# EAGLE design Layout_LEDs_Florian (EAGLE 5.07)
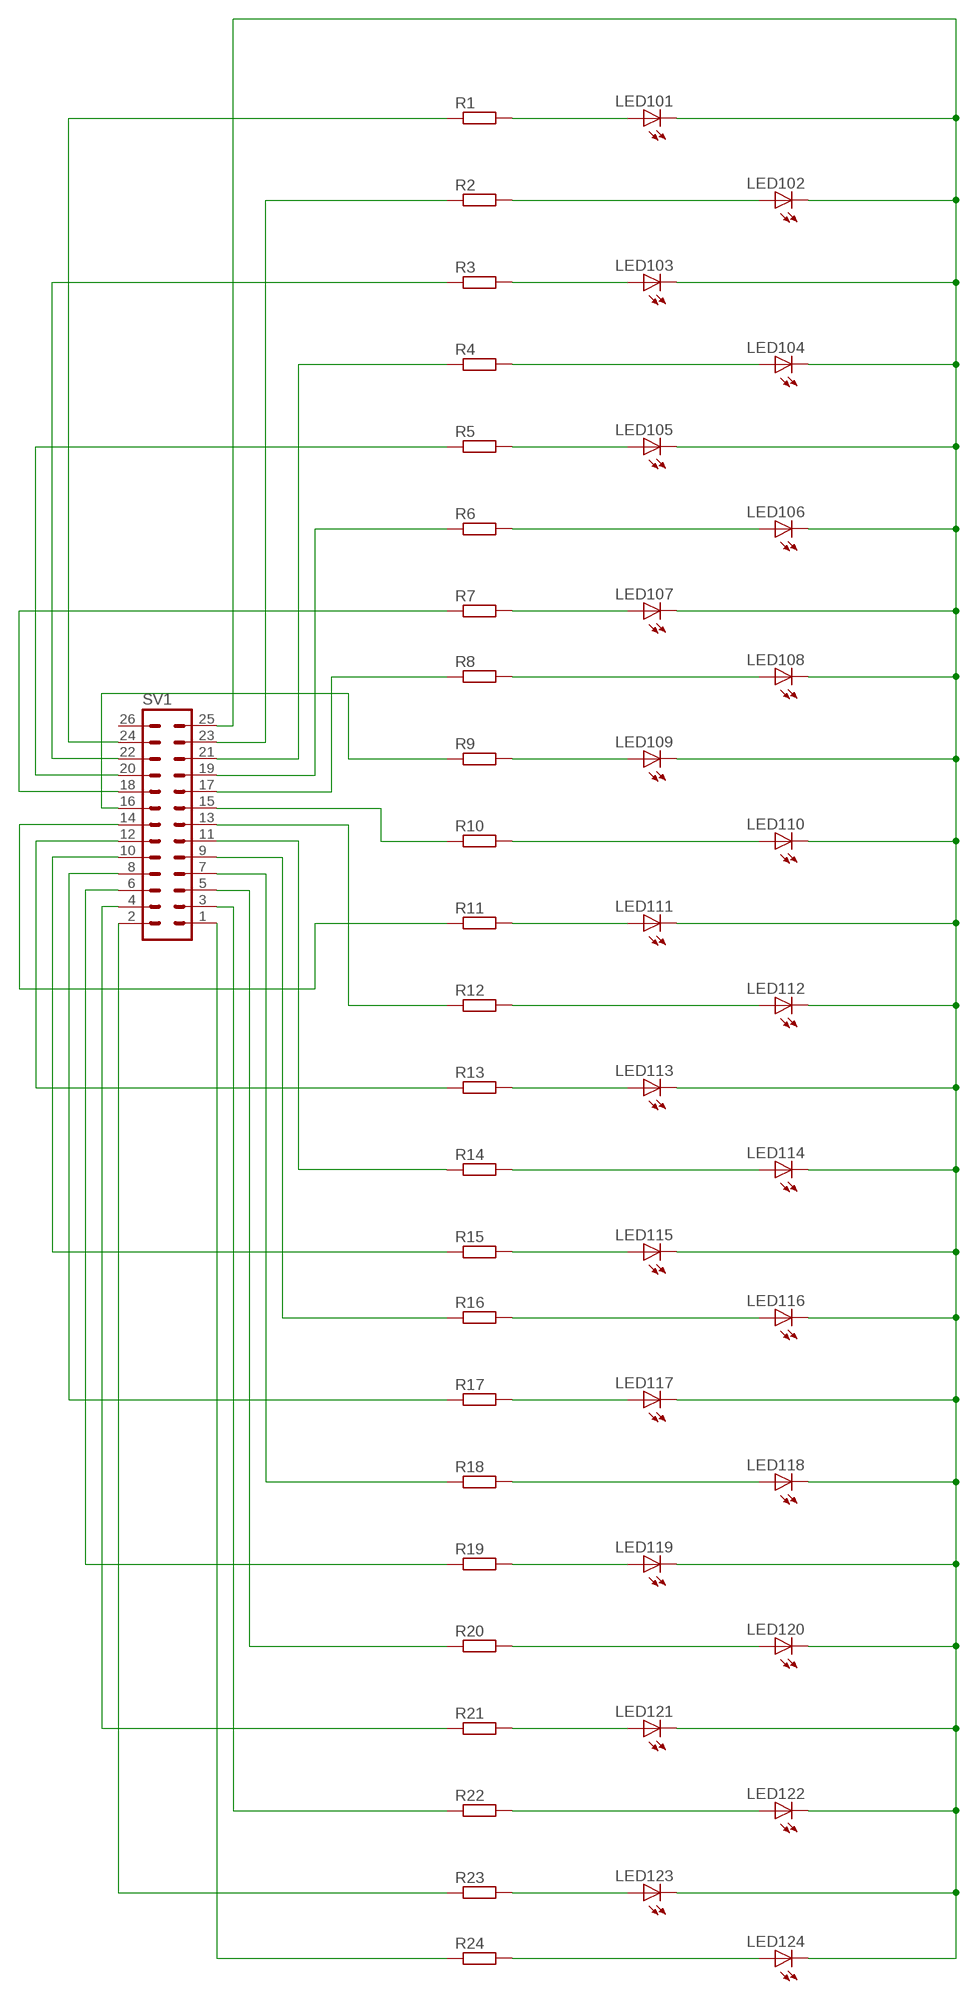
[diagram p0: schematic, sheet 1]

## Parts
LED101  LEDCHIP-LED0805  [CHIP-LED0805]
LED102  LEDCHIP-LED0805  [CHIP-LED0805]
LED103  LEDCHIP-LED0805  [CHIP-LED0805]
LED104  LEDCHIP-LED0805  [CHIP-LED0805]
LED105  LEDCHIP-LED0805  [CHIP-LED0805]
LED106  LEDCHIP-LED0805  [CHIP-LED0805]
LED107  LEDCHIP-LED0805  [CHIP-LED0805]
LED108  LEDCHIP-LED0805  [CHIP-LED0805]
LED109  LEDCHIP-LED0805  [CHIP-LED0805]
LED110  LEDCHIP-LED0805  [CHIP-LED0805]
LED111  LEDCHIP-LED0805  [CHIP-LED0805]
LED112  LEDCHIP-LED0805  [CHIP-LED0805]
LED113  LEDCHIP-LED0805  [CHIP-LED0805]
LED114  LEDCHIP-LED0805  [CHIP-LED0805]
LED115  LEDCHIP-LED0805  [CHIP-LED0805]
LED116  LEDCHIP-LED0805  [CHIP-LED0805]
LED117  LEDCHIP-LED0805  [CHIP-LED0805]
LED118  LEDCHIP-LED0805  [CHIP-LED0805]
LED119  LEDCHIP-LED0805  [CHIP-LED0805]
LED120  LEDCHIP-LED0805  [CHIP-LED0805]
LED121  LEDCHIP-LED0805  [CHIP-LED0805]
LED122  LEDCHIP-LED0805  [CHIP-LED0805]
LED123  LEDCHIP-LED0805  [CHIP-LED0805]
LED124  LEDCHIP-LED0805  [CHIP-LED0805]
R1  R-EU_M1406  [M1406]
R2  R-EU_M1406  [M1406]
R3  R-EU_M1406  [M1406]
R4  R-EU_M1406  [M1406]
R5  R-EU_M1406  [M1406]
R6  R-EU_M1406  [M1406]
R7  R-EU_M1406  [M1406]
R8  R-EU_M1406  [M1406]
R9  R-EU_M1406  [M1406]
R10  R-EU_M1406  [M1406]
R11  R-EU_M1406  [M1406]
R12  R-EU_M1406  [M1406]
R13  R-EU_M1406  [M1406]
R14  R-EU_M1406  [M1406]
R15  R-EU_M1406  [M1406]
R16  R-EU_M1406  [M1406]
R17  R-EU_M1406  [M1406]
R18  R-EU_M1406  [M1406]
R19  R-EU_M1406  [M1406]
R20  R-EU_M1406  [M1406]
R21  R-EU_M1406  [M1406]
R22  R-EU_M1406  [M1406]
R23  R-EU_M1406  [M1406]
R24  R-EU_M1406  [M1406]
SV1  MA13-2  [MA13-2]

## Nets
N$1: LED101.A R1.2
N$2: LED102.A R2.2
N$3: LED103.A R3.2
N$4: LED104.A R4.2
N$5: LED105.A R5.2
N$6: LED106.A R6.2
N$7: LED107.A R7.2
N$8: LED108.A R8.2
N$9: LED109.A R9.2
N$10: LED110.A R10.2
N$11: LED111.A R11.2
N$12: LED112.A R12.2
N$13: LED113.A R13.2
N$14: LED114.A R14.2
N$15: LED115.A R15.2
N$16: LED116.A R16.2
N$17: LED117.A R17.2
N$18: LED118.A R18.2
N$19: LED119.A R19.2
N$20: LED120.A R20.2
N$21: LED121.A R21.2
N$22: LED122.A R22.2
N$23: LED123.A R23.2
N$24: LED124.A R24.2
N$25: LED101.C LED102.C LED103.C LED104.C LED105.C LED106.C LED107.C LED108.C LED109.C LED110.C LED111.C LED112.C LED113.C LED114.C LED115.C LED116.C LED117.C LED118.C LED119.C LED120.C LED121.C LED122.C LED123.C LED124.C SV1.25
N$26: R1.1 SV1.24
N$27: R2.1 SV1.23
N$28: R4.1 SV1.21
N$29: R5.1 SV1.20
N$30: R6.1 SV1.19
N$31: R3.1 SV1.22
N$32: R7.1 SV1.18
N$33: R8.1 SV1.17
N$34: R9.1 SV1.16
N$35: R10.1 SV1.15
N$36: R12.1 SV1.13
N$37: R11.1 SV1.14
N$38: R13.1 SV1.12
N$39: R14.1 SV1.11
N$40: R15.1 SV1.10
N$41: R16.1 SV1.9
N$42: R17.1 SV1.8
N$43: R18.1 SV1.7
N$44: R20.1 SV1.5
N$45: R21.1 SV1.4
N$46: R22.1 SV1.3
N$47: R23.1 SV1.2
N$48: R24.1 SV1.1
N$56: R19.1 SV1.6
Unconnected: SV1.26

## Library data of the parts
LED101-LED124 = led:LED: LED OSRAM: - CHIPLED LG R971, LG N971, LY N971, LG Q971, LY Q971, LO R971, LY R971 LH N974, LH R974 LS Q976, LO Q976, LY Q976 LO Q996 - Hyper CHIPLED LW Q18S LB Q993, LB Q99A, LB R99A - SideLED LS A670, LO A670, LY A670, LG A670, LP A670 LB A673, LV A673, LT A673, LW A673 LH A674 LY A675 LS A676, LA A676, LO A676, LY A676, LW A676 LS A679, LY A679, LG A679 - Hyper Micro SIDELED® LS Y876, LA Y876, LO Y876, LY Y876 LT Y87S - SmartLED LW L88C, LW L88S LB L89C, LB L89S, LG L890 LS L89K, LO L89K, LY L89K LS L896, LA L896, LO L896, LY L896 - TOPLED LS T670, LO T670, LY T670, LG T670, LP T670 LSG T670, LSP T670, LSY T670, LOP T670, LYG T670 LG T671, LOG T671, LSG T671 LB T673, LV T673, LT T673, LW T673 LH T674 LS T676, LA T676, LO T676, LY T676, LB T676, LH T676, LSB T676, LW T676 LB T67C, LV T67C, LT T67C, LS T67K, LO T67K, LY T67K, LW E67C LS E67B, LA E67B, LO E67B, LY E67B, LB E67C, LV E67C, LT E67C LW T67C LS T679, LY T679, LG T679 LS T770, LO T770, LY T770, LG T770, LP T770 LB T773, LV T773, LT T773, LW T773 LH T774 LS E675, LA E675, LY E675, LS T675 LS T776, LA T776, LO T776, LY T776, LB T776 LHGB T686 LT T68C, LB T68C - Hyper Mini TOPLED® LB M676 - Mini TOPLED Santana® LG M470 LS M47K, LO M47K, LY M47K Source: http://www.osram.convergy.de LUXEON: - LUMILED® LXK2-PW12-R00, LXK2-PW12-S00, LXK2-PW14-U00, LXK2-PW14-V00 LXK2-PM12-R00, LXK2-PM12-S00, LXK2-PM14-U00 LXK2-PE12-Q00, LXK2-PE12-R00, LXK2-PE12-S00, LXK2-PE14-T00, LXK2-PE14-U00 LXK2-PB12-K00, LXK2-PB12-L00, LXK2-PB12-M00, LXK2-PB14-N00, LXK2-PB14-P00, LXK2-PB14-Q00 LXK2-PR12-L00, LXK2-PR12-M00, LXK2-PR14-Q00, LXK2-PR14-R00 LXK2-PD12-Q00, LXK2-PD12-R00, LXK2-PD12-S00 LXK2-PH12-R00, LXK2-PH12-S00 LXK2-PL12-P00, LXK2-PL12-Q00, LXK2-PL12-R00 Source: www.luxeon.com KINGBRIGHT: KA-3528ASYC Source: www.kingbright.com
R1-R24 = rcl:R-EU_: RESISTOR, European symbol
SV1 = con-lstb:MA13-2: PIN HEADER

## Board
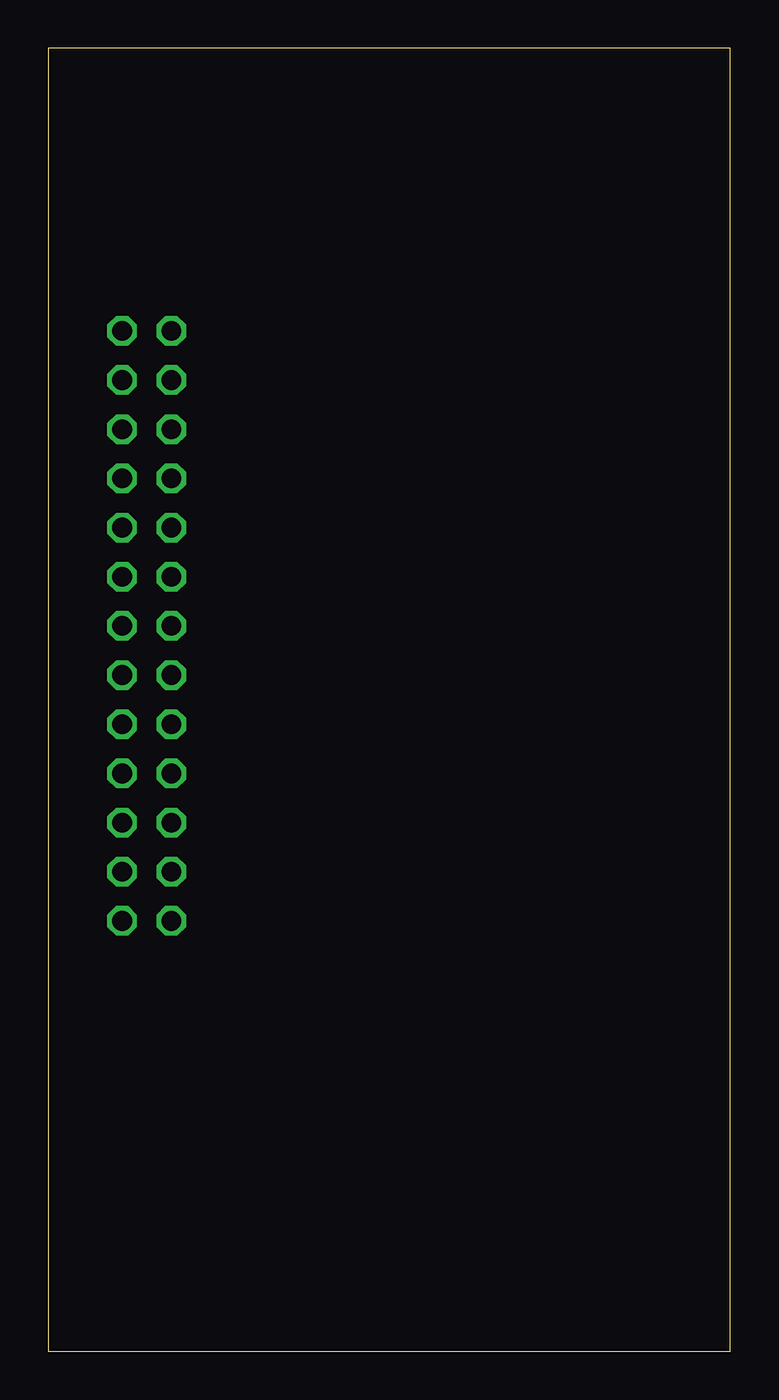
[diagram p1: board, top side]
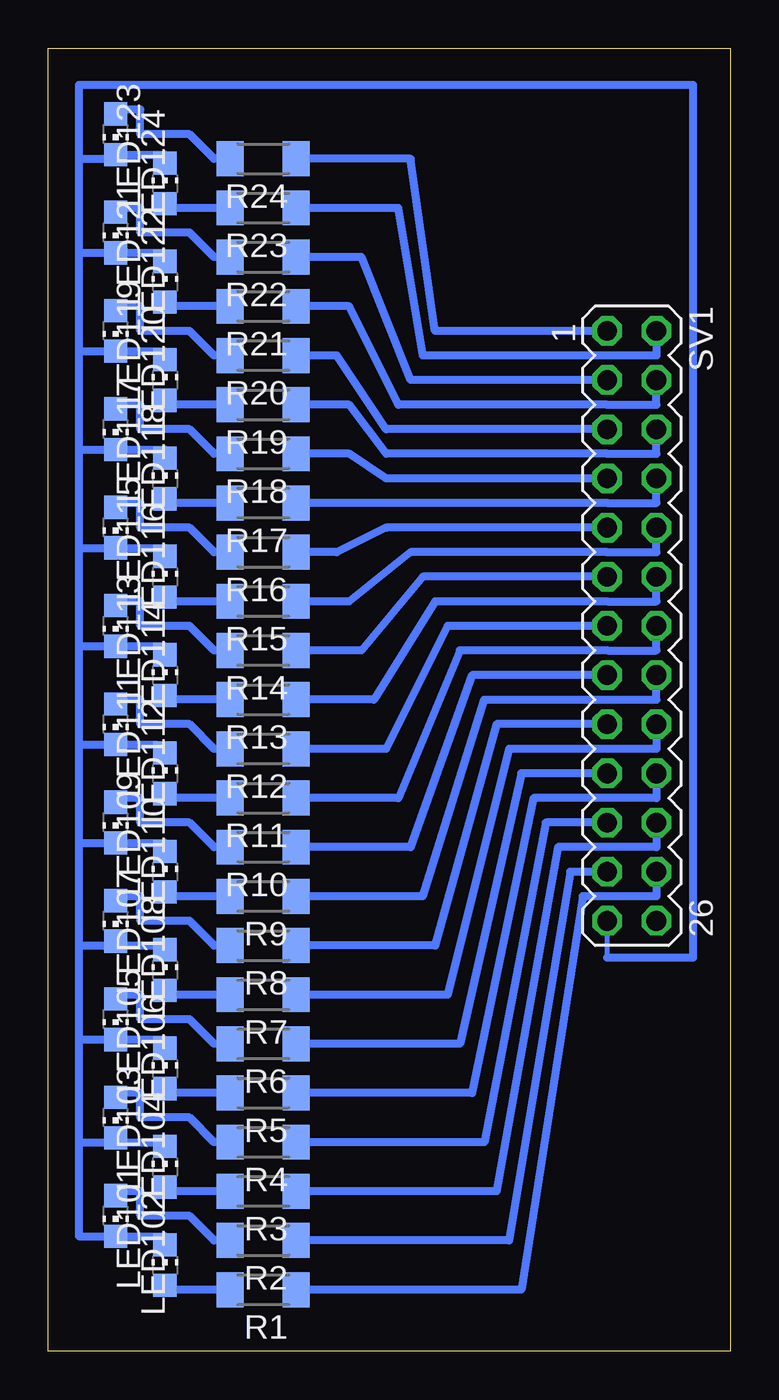
[diagram p2: board, bottom side, seen from below]

Size 35.23 x 67.3 mm. Coordinates in mm from the lower left corner, seen from the top.
Outline: 0,0 35.23,0 35.23,67.3 0,67.3 0,0
Copper layers (1*16): Top 0.035mm / dielectric 1.5mm / Bottom 0.035mm
Design rules "default": minimum track width 10mil, minimum drill 24mil, track to track 8mil, track to pad 8mil, pad to pad 8mil, via to via 8mil, smd to smd 8mil, copper to edge 40mil, drill to drill 8mil, minimum pad ring 10mil, minimum via ring 8mil, stop-mask expansion 4mil, vias tented up to drill 0mil, thermal gap 10mil

### Footprints (pad centres in the part's own frame; a part is rotated, then mirrored left to right if it is on the bottom)
CHIP-LED0805 = smd 1.2 x 1.2: A 0,-1.05; C 0,1.05
M1406 = smd 1.4 x 1.8: 1 -1.7,0; 2 1.7,0
MA13-2 = drill 1.016 octagon: 1 -15.24,-1.27; 2 -15.24,1.27; 3 -12.7,-1.27; 4 -12.7,1.27; 5 -10.16,-1.27; 6 -10.16,1.27; 7 -7.62,-1.27; 8 -7.62,1.27; 9 -5.08,-1.27; 10 -5.08,1.27; 11 -2.54,-1.27; 12 -2.54,1.27; 13 0,-1.27; 14 0,1.27; 15 2.54,-1.27; 16 2.54,1.27; 17 5.08,-1.27; 18 5.08,1.27; 19 7.62,-1.27; 20 7.62,1.27; 21 10.16,-1.27; 22 10.16,1.27; 23 12.7,-1.27; 24 12.7,1.27; 25 15.24,-1.27; 26 15.24,1.27

### Placement (x,y rotation side)
LED101  29.21,4.45 0 bottom
LED102  31.75,6.99 180 bottom
LED103  29.21,9.53 0 bottom
LED104  31.75,12.06 180 bottom
LED105  29.21,14.61 0 bottom
LED106  31.75,17.14 180 bottom
LED107  29.21,19.68 0 bottom
LED108  31.75,22.23 180 bottom
LED109  29.21,24.77 0 bottom
LED110  31.75,27.3 180 bottom
LED111  29.21,29.84 0 bottom
LED112  31.75,32.38 180 bottom
LED113  29.21,34.92 0 bottom
LED114  31.75,37.47 180 bottom
LED115  29.21,40.01 0 bottom
LED116  31.75,42.55 180 bottom
LED117  29.21,45.09 0 bottom
LED118  31.75,47.62 180 bottom
LED119  29.21,50.16 0 bottom
LED120  31.75,52.7 180 bottom
LED121  29.21,55.24 0 bottom
LED122  31.75,57.78 180 bottom
LED123  29.21,60.33 0 bottom
LED124  31.75,62.87 180 bottom
R1  24.13,3.17 180 bottom
R2  24.13,5.71 180 bottom
R3  24.13,8.26 180 bottom
R4  24.13,10.79 180 bottom
R5  24.13,13.34 180 bottom
R6  24.13,15.88 180 bottom
R7  24.13,18.41 180 bottom
R8  24.13,20.95 180 bottom
R9  24.13,23.5 180 bottom
R10  24.13,26.04 180 bottom
R11  24.13,28.57 180 bottom
R12  24.13,31.11 180 bottom
R13  24.13,33.66 180 bottom
R14  24.13,36.2 180 bottom
R15  24.13,38.73 180 bottom
R16  24.13,41.27 180 bottom
R17  24.13,43.81 180 bottom
R18  24.13,46.35 180 bottom
R19  24.13,48.9 180 bottom
R20  24.13,51.44 180 bottom
R21  24.13,53.98 180 bottom
R22  24.13,56.52 180 bottom
R23  24.13,59.05 180 bottom
R24  24.13,61.59 180 bottom
SV1  5.08,37.47 270 bottom

### Tracks (layer width: path | path; a pad name or v marks a point on that pad's centre or on a via)
N$1
  Bottom 0.406: R1.2 28.99,3.17 LED101.A
N$2
  Bottom 0.406: LED102.A 31.75,8.26 30.48,8.26 30.48,6.99 27.94,6.99 26.67,5.71 R2.2
N$3
  Bottom 0.406: R3.2 28.99,8.26 LED103.A
N$4
  Bottom 0.406: R4.2 26.67,10.79 27.94,12.06 30.48,12.06 30.48,13.34 31.53,13.34 LED104.A
N$5
  Bottom 0.406: R5.2 28.99,13.34 LED105.A
N$6
  Bottom 0.406: R6.2 26.67,15.88 27.94,17.14 30.48,17.14 30.48,18.41 31.53,18.41 LED106.A
N$7
  Bottom 0.406: R7.2 28.99,18.41 LED107.A
N$8
  Bottom 0.406: 31.75,23.5 LED108.A 31.53,23.5 30.48,23.5 30.48,22.23 27.94,22.23 26.67,20.95 R8.2
N$9
  Bottom 0.406: R9.2 28.99,23.5 LED109.A
N$10
  Bottom 0.406: LED110.A 31.75,28.57 30.48,28.57 30.48,27.3 27.94,27.3 26.67,26.04 R10.2
N$11
  Bottom 0.406: R11.2 28.99,28.57 LED111.A
N$12
  Bottom 0.406: R12.2 26.67,31.11 27.94,32.38 30.48,32.38 30.48,33.66 31.53,33.66 LED112.A
N$13
  Bottom 0.406: 29.21,33.66 LED113.A 28.99,33.66 R13.2
N$14
  Bottom 0.406: R14.2 26.67,36.2 27.94,37.47 30.48,37.47 30.48,38.73 31.53,38.73 LED114.A
N$15
  Bottom 0.406: R15.2 28.99,38.73 LED115.A
N$16
  Bottom 0.406: R16.2 26.67,41.27 27.94,42.55 30.48,42.55 30.48,43.81 31.53,43.81 LED116.A
N$17
  Bottom 0.406: R17.2 28.99,43.81 LED117.A
N$18
  Bottom 0.406: R18.2 26.67,46.35 27.94,47.62 30.48,47.62 30.48,48.9 31.53,48.9 LED118.A
N$19
  Bottom 0.406: R19.2 28.99,48.9 LED119.A
N$20
  Bottom 0.406: R20.2 26.67,51.44 27.94,52.7 30.48,52.7 30.48,53.98 31.53,53.98 LED120.A
N$21
  Bottom 0.406: R21.2 28.99,53.98 LED121.A
N$22
  Bottom 0.406: R22.2 26.67,56.52 27.94,57.78 30.48,57.78 30.48,59.05 31.53,59.05 LED122.A
N$23
  Bottom 0.406: R23.2 28.99,59.05 LED123.A
N$24
  Bottom 0.406: R24.2 26.67,61.59 27.94,62.87 30.48,62.87 30.48,64.14 31.53,64.14 LED124.A
N$25
  Bottom 0.254: 6.35,20.32 6.35,21.59 SV1.25
  Bottom 0.406: LED101.C 29.21,5.93 LED102.C 33.66,5.93 33.66,10.79 | 31.75,10.79 LED104.C | 31.75,10.79 29.21,10.79 LED103.C | LED105.C 29.21,16.09 LED106.C 33.66,16.09 | 31.75,20.95 LED108.C | 31.75,20.95 29.21,20.95 LED107.C | LED113.C 29.21,36.41 LED114.C 33.66,36.41 | LED115.C 29.21,41.49 LED116.C 33.66,41.49 | LED117.C 29.21,46.58 LED118.C 33.66,46.58 | LED119.C 29.21,51.66 LED120.C 33.66,51.66 | LED123.C 29.21,61.81 LED124.C 31.75,61.59 33.66,61.59 | 33.66,61.59 33.66,56.73 | 33.66,41.49 33.66,36.41 | 33.66,20.95 33.66,16.09 | LED121.C 29.21,56.73 LED122.C 33.66,56.73 | 33.66,10.79 31.75,10.79 | 33.66,16.09 33.66,10.79 | 33.66,20.95 31.75,20.95 | LED109.C 29.21,26.25 LED110.C 33.66,26.25 | 29.21,31.11 LED111.C 29.65,31.34 LED112.C 33.66,31.34 | 6.35,20.32 1.91,20.32 1.91,65.41 33.66,65.41 33.66,61.59 | 33.66,56.73 33.66,51.66 | 33.66,51.66 33.66,46.58 | 33.66,46.58 33.66,41.49 | 33.66,36.41 33.66,31.34 | 33.66,31.34 33.66,26.25 | 33.66,26.25 33.66,20.95
N$26
  Bottom 0.406: SV1.24 3.81,23.5 7.62,23.5 10.79,3.17 R1.1
N$27
  Bottom 0.406: SV1.23 8.26,24.77 11.43,5.71 R2.1
N$28
  Bottom 0.406: SV1.21 9.53,27.3 12.7,10.79 R4.1
N$29
  Bottom 0.406: SV1.20 3.81,28.57 10.16,28.57 13.34,13.34 R5.1
N$30
  Bottom 0.406: SV1.19 10.79,29.84 13.97,15.88 R6.1
N$31
  Bottom 0.406: SV1.22 3.81,26.04 8.89,26.04 12.06,8.26 R3.1
N$32
  Bottom 0.406: SV1.18 3.81,31.11 11.43,31.11 14.61,18.41 R7.1
N$33
  Bottom 0.406: SV1.17 12.06,32.38 15.24,20.95 R8.1
N$34
  Bottom 0.406: R9.1 15.88,23.5 12.7,33.66 6.35,33.66 3.81,33.66 SV1.16
N$35
  Bottom 0.406: SV1.15 13.34,34.92 16.51,26.04 R10.1
N$36
  Bottom 0.406: SV1.13 14.61,37.47 17.78,31.11 R12.1
N$37
  Bottom 0.406: R11.1 17.14,28.57 13.97,36.2 6.35,36.2 3.81,36.2 SV1.14
N$38
  Bottom 0.406: R13.1 18.41,33.66 15.24,38.73 6.35,38.73 3.81,38.73 SV1.12
N$39
  Bottom 0.406: SV1.11 15.88,40.01 19.05,36.2 R14.1
N$40
  Bottom 0.406: R15.1 19.68,38.73 16.51,41.27 6.35,41.27 3.81,41.27 SV1.10
N$41
  Bottom 0.254: R16.1 22.86,41.91
  Bottom 0.406: SV1.9 17.78,42.55 20.32,41.27 R16.1
N$42
  Bottom 0.406: R17.1 6.35,43.81 3.81,43.81 SV1.8
N$43
  Bottom 0.406: SV1.7 17.78,45.09 19.68,46.35 R18.1
N$44
  Bottom 0.406: SV1.5 17.78,47.62 20.32,51.44 R20.1
N$45
  Bottom 0.406: R21.1 19.68,53.98 17.14,48.9 6.35,48.9 3.81,48.9 SV1.4
N$46
  Bottom 0.406: SV1.3 16.51,50.16 19.05,56.52 R22.1
N$47
  Bottom 0.406: R23.1 17.14,59.05 15.88,51.44 6.35,51.44 3.81,51.44 SV1.2
N$48
  Bottom 0.406: SV1.1 15.24,52.7 16.51,61.59 R24.1
N$56
  Bottom 0.406: R19.1 19.68,48.9 17.78,46.35 6.35,46.35 3.81,46.35 SV1.6